# Altium schematic sheet TSE_mother_board_periph_commutation.SchDoc
size 594 x 420 mm; SheetNumber: 3; SheetTotal: 3
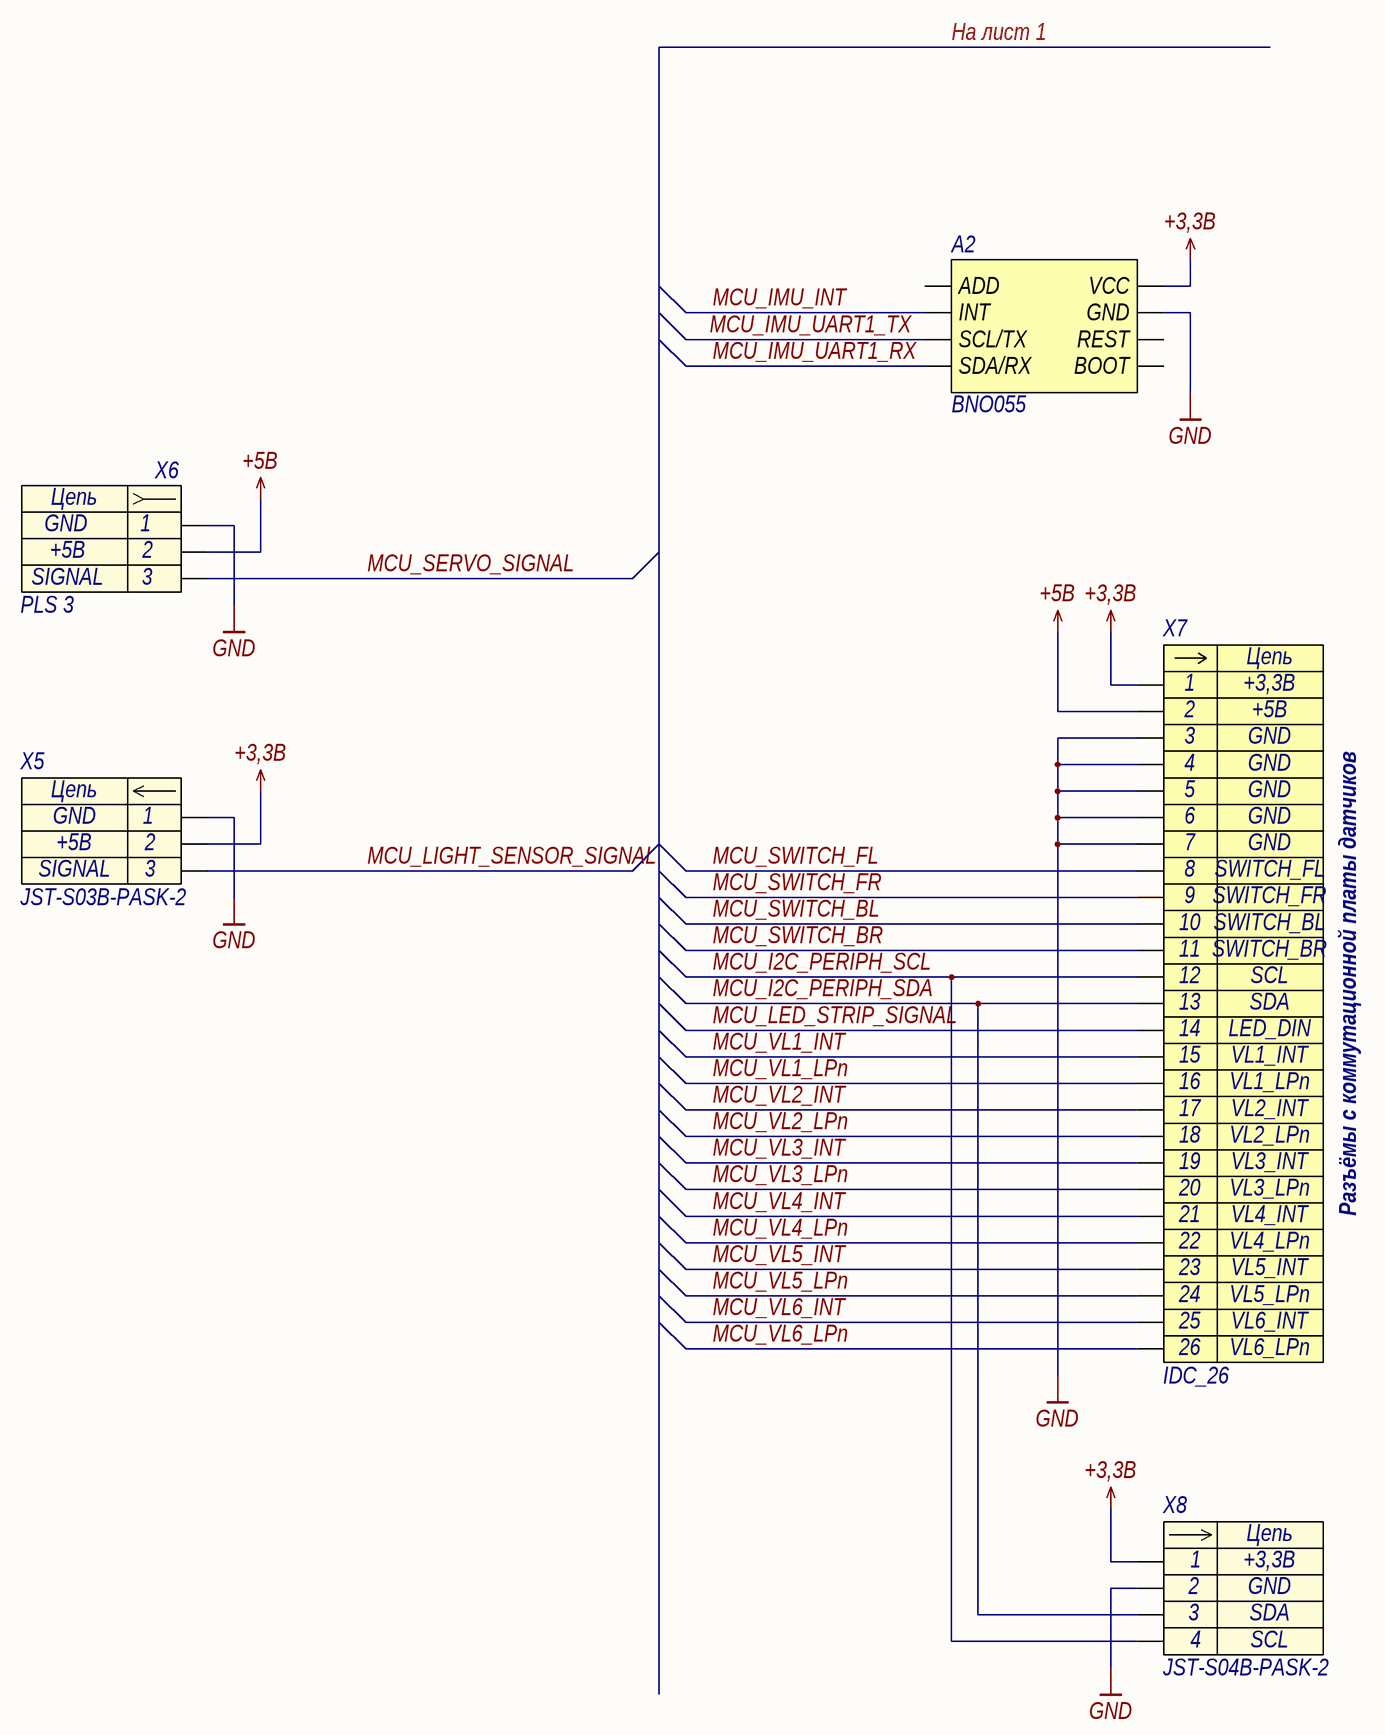
[diagram p0: TSE_mother_board_periph_commutation.SchDoc]

## Parts
A2  BNO055  [BNO055]
X5  JST-S03B-PASK-2  [JST-S03B-PASK-2]
X6  PLS 3  [pls-2,54-3-tht-v]
X7  IDC_26  [IDC1.27_26]
X8  JST-S04B-PASK-2  [JST-S04B-PASK-2]

## Nets
+3,3В: A2.1(VCC) X5.2 X7.1 X8.1
+5В: X6.2 X7.2
GND: A2.2(GND) X5.1 X6.1 X7.3 X7.4 X7.5 X7.6 X7.7 X8.2
MCU_I2C_PERIPH_SCL: X7.12 X8.4
MCU_I2C_PERIPH_SDA: X7.13 X8.3
MCU_IMU_INT: A2.6(INT)
MCU_IMU_UART1_RX: A2.3(SDA/RX)
MCU_IMU_UART1_TX: A2.4(SCL/TX)
MCU_LED_STRIP_SIGNAL: X7.14
MCU_LIGHT_SENSOR_SIGNAL: X5.3
MCU_SERVO_SIGNAL: X6.3
MCU_SWITCH_BL: X7.10
MCU_SWITCH_BR: X7.11
MCU_SWITCH_FL: X7.8
MCU_SWITCH_FR: X7.9
MCU_VL1_INT: X7.15
MCU_VL1_LPn: X7.16
MCU_VL2_INT: X7.17
MCU_VL2_LPn: X7.18
MCU_VL3_INT: X7.19
MCU_VL3_LPn: X7.20
MCU_VL4_INT: X7.21
MCU_VL4_LPn: X7.22
MCU_VL5_INT: X7.23
MCU_VL5_LPn: X7.24
MCU_VL6_INT: X7.25
MCU_VL6_LPn: X7.26

Not connected (* = marked no-connect by the designer): A2 5(ADD) 7(BOOT) 8(REST)

## Notes on the sheet
- На лист 1
- Разъёмы с коммутационной платы датчиков
- Подп. и дата
- Инв. № дубл.
- Взам. инв. №
- Инв. № подл.
- Лист
- Файл:
- Изм.
- № докум.
- Подп.
- Дата
- Копировал
- Формат
- (in symbol IDC_26) Цепь
- (in symbol JST-S03B-PASK-2) Цепь
- (in symbol JST-S04B-PASK-2) Цепь
- (in symbol PLS-3 ICSP_1) Цепь

## Library data of the parts
A2 = BNO055: 9-осевой гироскоп и акселерометр; Наименование: BNO055
X5 = JST-S03B-PASK-2: Разъем - 3 конт. угловая вилка на плату, шаг 2,00 мм; Contact_1: GND; Contact_2: +5В; Contact_3: SIGNAL; Наименование: JST-S03B-PASK-2
X6 = PLS-3 ICSP_1: Разъем - 6 конт. 3, шаг 2,54 мм; Contact_1: GND; Contact_2: +5В; Contact_3: SIGNAL; Name: PLS 3
X7 = IDC_26: Разъем - 26 конт. прямая вилка на плату; Contact_1: +3,3В; Contact_2: +5В; Contact_3: GND; Contact_8: SWITCH_FL; Contact_9: SWITCH_FR; Contact_10: SWITCH_BL; Contact_11: SWITCH_BR; Contact_12: SCL; Contact_13: SDA; Contact_14: LED_DIN; Contact_15: VL1_INT; Contact_16: VL1_LPn; Contact_17: VL2_INT; Contact_18: VL2_LPn; Contact_19: VL3_INT; Contact_20: VL3_LPn; Contact_21: VL4_INT; Contact_22: VL4_LPn; Contact_23: VL5_INT; Contact_24: VL5_LPn; Contact_25: VL6_INT; Contact_26: VL6_LPn; Наименование: IDC_26; Contact_4: GND; Contact_5: GND; Contact_6: GND; Contact_7: GND
X8 = JST-S04B-PASK-2: Разъем - 4 конт. угловая вилка на плату, шаг 2,00 мм; Contact_1: +3,3В; Contact_2: GND; Contact_3: SDA; Contact_4: SCL; Наименование: JST-S04B-PASK-2